# EAGLE design billdetector1a (EAGLE 5.11)
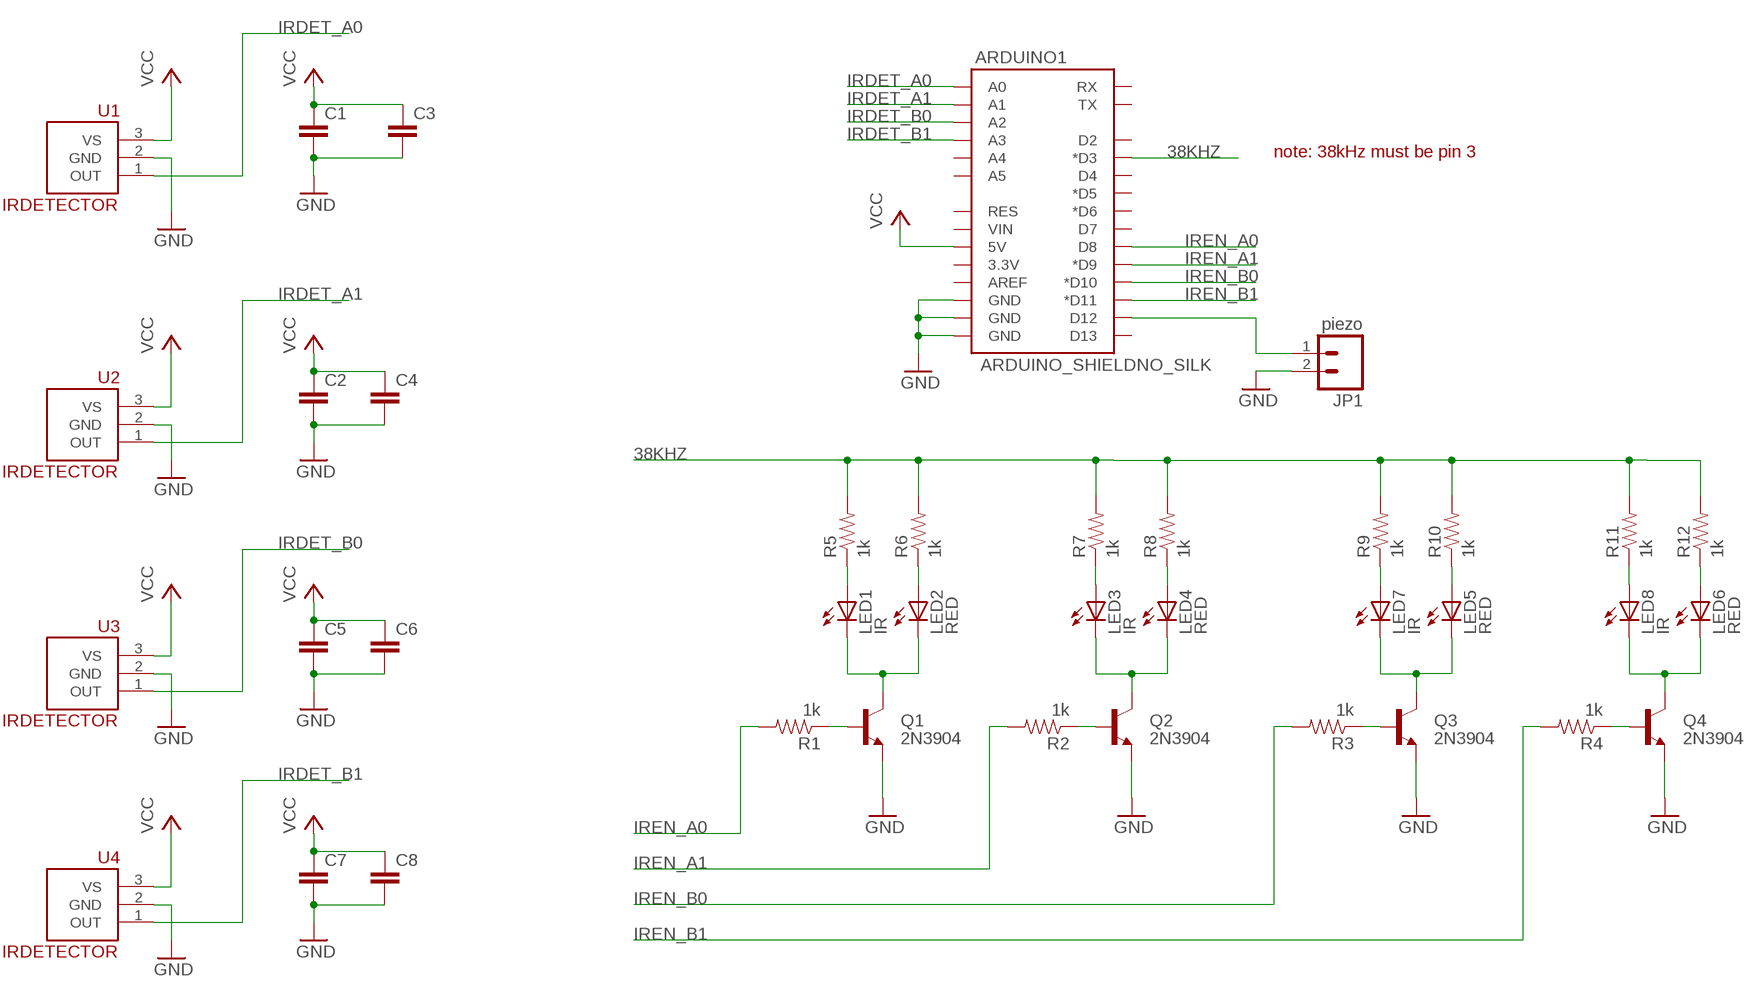
[diagram p0: schematic, sheet 1]

## Parts
ARDUINO1  ARDUINO_SHIELDNO_SILK  [DUEMILANOVE_VIAS]
C1  CAPPTH  [CAP-PTH-SMALL]
C2  CAPPTH  [CAP-PTH-SMALL]
C3  CAPPTH2  [CAP-PTH-SMALL2]
C4  CAPPTH2  [CAP-PTH-SMALL2]
C5  CAPPTH  [CAP-PTH-SMALL]
C6  CAPPTH2  [CAP-PTH-SMALL2]
C7  CAPPTH  [CAP-PTH-SMALL]
C8  CAPPTH2  [CAP-PTH-SMALL2]
JP1  piezo  M02LOCK  [1X02_LOCK]
LED1  IR  LED5MM  [LED5MM]
LED2  RED  LED5MM  [LED5MM]
LED3  IR  LED5MM  [LED5MM]
LED4  RED  LED5MM  [LED5MM]
LED5  RED  LED5MM  [LED5MM]
LED6  RED  LED5MM  [LED5MM]
LED7  IR  LED5MM  [LED5MM]
LED8  IR  LED5MM  [LED5MM]
Q1  2N3904  TRANSISTOR_NPNTO92  [TO-92]
Q2  2N3904  TRANSISTOR_NPNTO92  [TO-92]
Q3  2N3904  TRANSISTOR_NPNTO92  [TO-92]
Q4  2N3904  TRANSISTOR_NPNTO92  [TO-92]
R1  1k  RESISTORAXIAL-0.3  [AXIAL-0.3]
R2  1k  RESISTORAXIAL-0.3  [AXIAL-0.3]
R3  1k  RESISTORAXIAL-0.3  [AXIAL-0.3]
R4  1k  RESISTORAXIAL-0.3  [AXIAL-0.3]
R5  1k  RESISTORAXIAL-0.3  [AXIAL-0.3]
R6  1k  RESISTORAXIAL-0.3  [AXIAL-0.3]
R7  1k  RESISTORAXIAL-0.3  [AXIAL-0.3]
R8  1k  RESISTORAXIAL-0.3  [AXIAL-0.3]
R9  1k  RESISTORAXIAL-0.3  [AXIAL-0.3]
R10  1k  RESISTORAXIAL-0.3  [AXIAL-0.3]
R11  1k  RESISTORAXIAL-0.3  [AXIAL-0.3]
R12  1k  RESISTORAXIAL-0.3  [AXIAL-0.3]
U1  IRDETECTOR  [TSOP-3PIN-2.54MM]
U2  IRDETECTOR  [TSOP-3PIN-2.54MM]
U3  IRDETECTOR  [TSOP-3PIN-2.54MM]
U4  IRDETECTOR  [TSOP-3PIN-2.54MM]

## Nets
38KHZ: ARDUINO1.D3(*D3) R5.P$2 R6.P$2 R7.P$2 R8.P$2 R9.P$2 R10.P$2 R11.P$2 R12.P$2
GND: ARDUINO1.GND@0(GND) ARDUINO1.GND@1(GND) ARDUINO1.GND@2(GND) C1.2 C2.2 C3.2 C4.2 C5.2 C6.2 C7.2 C8.2 JP1.2 Q1.1(E) Q2.1(E) Q3.1(E) Q4.1(E) U1.2(GND) U2.2(GND) U3.2(GND) U4.2(GND)
IRDET_A0: ARDUINO1.A0 U1.1(OUT)
IRDET_A1: ARDUINO1.A1 U2.1(OUT)
IRDET_B0: ARDUINO1.A2 U3.1(OUT)
IRDET_B1: ARDUINO1.A3 U4.1(OUT)
IREN_A0: ARDUINO1.D8 R1.P$2
IREN_A1: ARDUINO1.D9(*D9) R2.P$2
IREN_B0: ARDUINO1.D10(*D10) R3.P$2
IREN_B1: ARDUINO1.D11(*D11) R4.P$2
N$1: Q3.2(B) R3.P$1
N$2: Q4.2(B) R4.P$1
N$3: LED3.A R7.P$1
N$4: LED1.K(C) LED2.K(C) Q1.3(C)
N$5: Q1.2(B) R1.P$1
N$6: Q2.2(B) R2.P$1
N$7: ARDUINO1.D12 JP1.1
N$9: LED2.A R6.P$1
N$10: LED4.A R8.P$1
N$11: LED3.K(C) LED4.K(C) Q2.3(C)
N$13: LED1.A R5.P$1
N$15: LED5.A R10.P$1
N$16: LED6.A R12.P$1
N$17: LED7.A R9.P$1
N$18: LED8.A R11.P$1
N$19: LED5.K(C) LED7.K(C) Q3.3(C)
N$20: LED6.K(C) LED8.K(C) Q4.3(C)
VCC: ARDUINO1.5V C1.1 C2.1 C3.1 C4.1 C5.1 C6.1 C7.1 C8.1 U1.3(VS) U2.3(VS) U3.3(VS) U4.3(VS)
Unconnected: ARDUINO1.3.3V ARDUINO1.A4 ARDUINO1.A5 ARDUINO1.AREF ARDUINO1.D2 ARDUINO1.D4 ARDUINO1.D5(*D5) ARDUINO1.D6(*D6) ARDUINO1.D7 ARDUINO1.D13 ARDUINO1.RES ARDUINO1.RX ARDUINO1.TX ARDUINO1.VIN

## Notes on the sheet
- note: 38kHz must be pin 3

## Library data of the parts
ARDUINO1 = SparkFun-20110517:ARDUINO_SHIELD
C1-C8 = SparkFun-20110517:CAP: Capacitor Standard 0603 ceramic capacitor, and 0.1" leaded capacitor.
JP1 = SparkFun-20110517:M02: Header 2 Standard 2-pin 0.1" header. Use with straight break away headers (SKU : PRT-00116), right angle break away headers (PRT-00553), swiss pins (PRT-00743), machine pins (PRT-00117), and female headers (PRT-00115). Molex polarized connector foot print use with SKU : PRT-08233 with associated crimp pins and housings.
LED1-LED8 = SparkFun-20110517:LED: LEDs Standard schematic elements and footprints for 5mm, 3mm, 1206, and 0603 sized LEDs. 5mm - Spark Fun Electronics SKU : COM-00529 (and others)
Q1-Q4 = SparkFun-20110517:TRANSISTOR_NPN: Transistor NPN BJT configuration in SOT23 package. MMBT2222 is the common NPN we use. Double check BCE configuration again layout.
R1-R12 = SparkFun-20110517:RESISTOR: Resistor Basic schematic elements and footprints for 0603, 1206, and PTH resistors.
U1-U4 = todstuff:IRDETECTOR: Vishay TSOP348.., TSOP344.. IR receiver modules CARRIER FREQUENCY STD (AGC2,AGC8) NOISY ENV(AGC4) 30 kHz TSOP34830 TSOP34430 33 kHz TSOP34833 TSOP34433 36 kHz TSOP34836 TSOP34436 38 kHz TSOP34838 TSOP34438 40 kHz TSOP34840 TSOP34440 56 kHz TSOP34856 TSOP34456

## Board
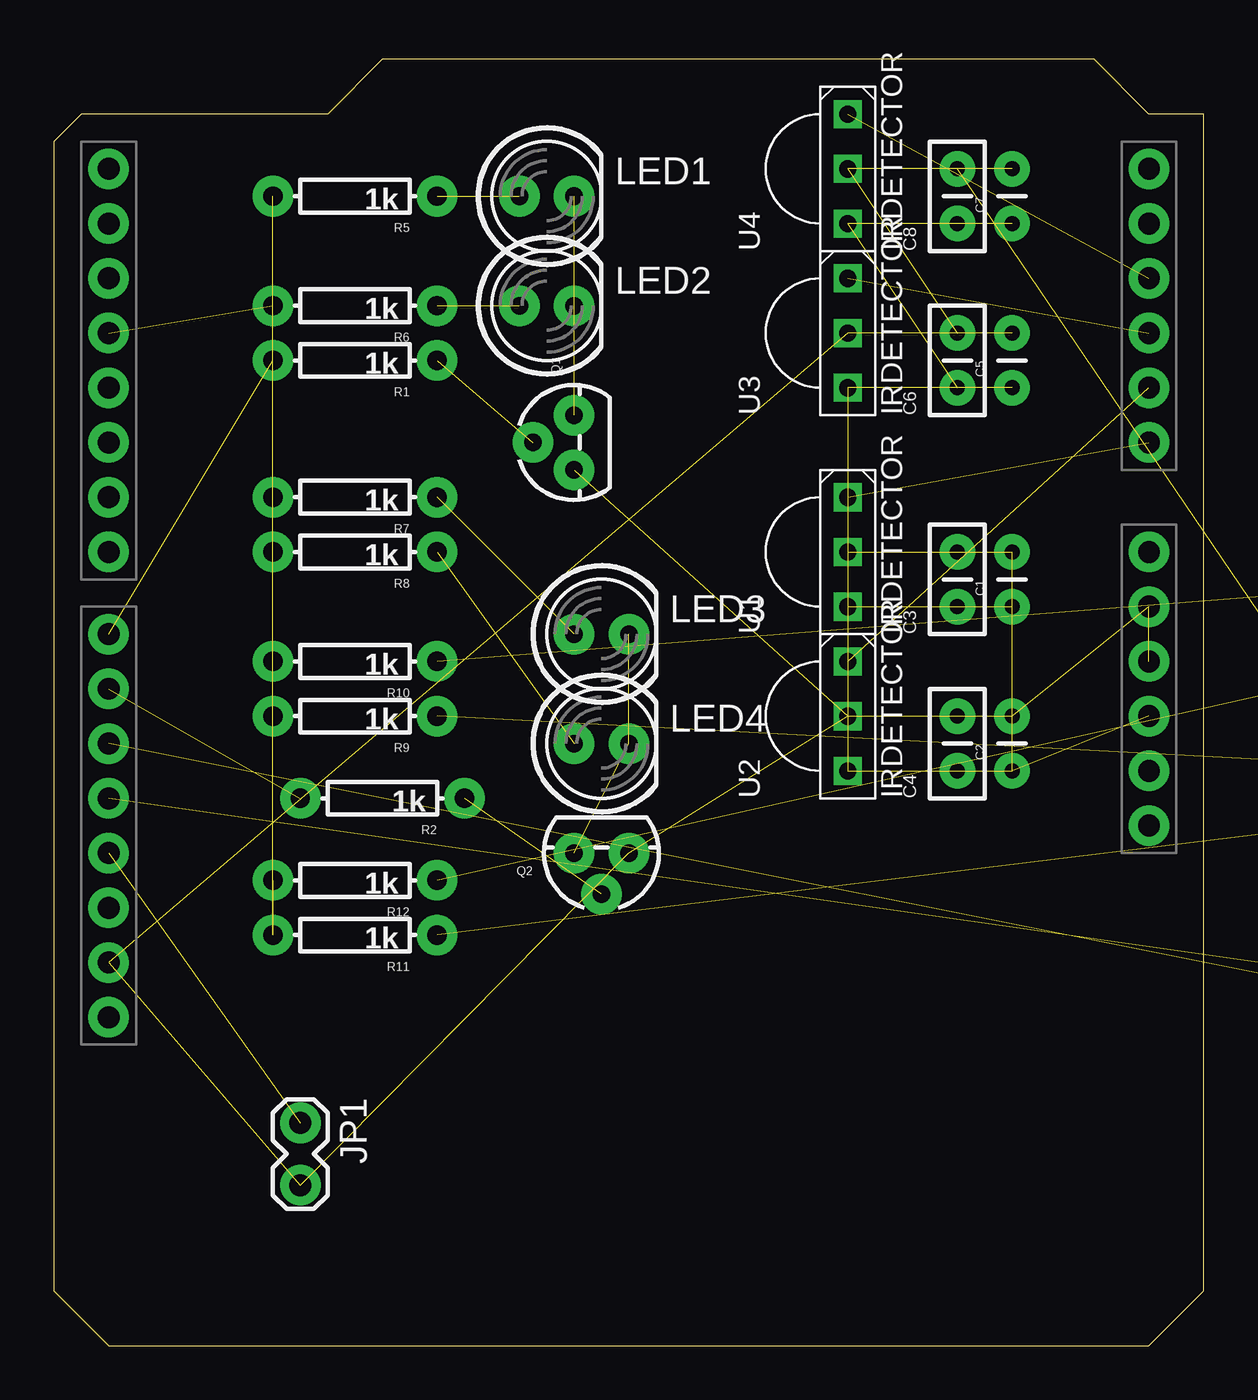
[diagram p1: board, top side]
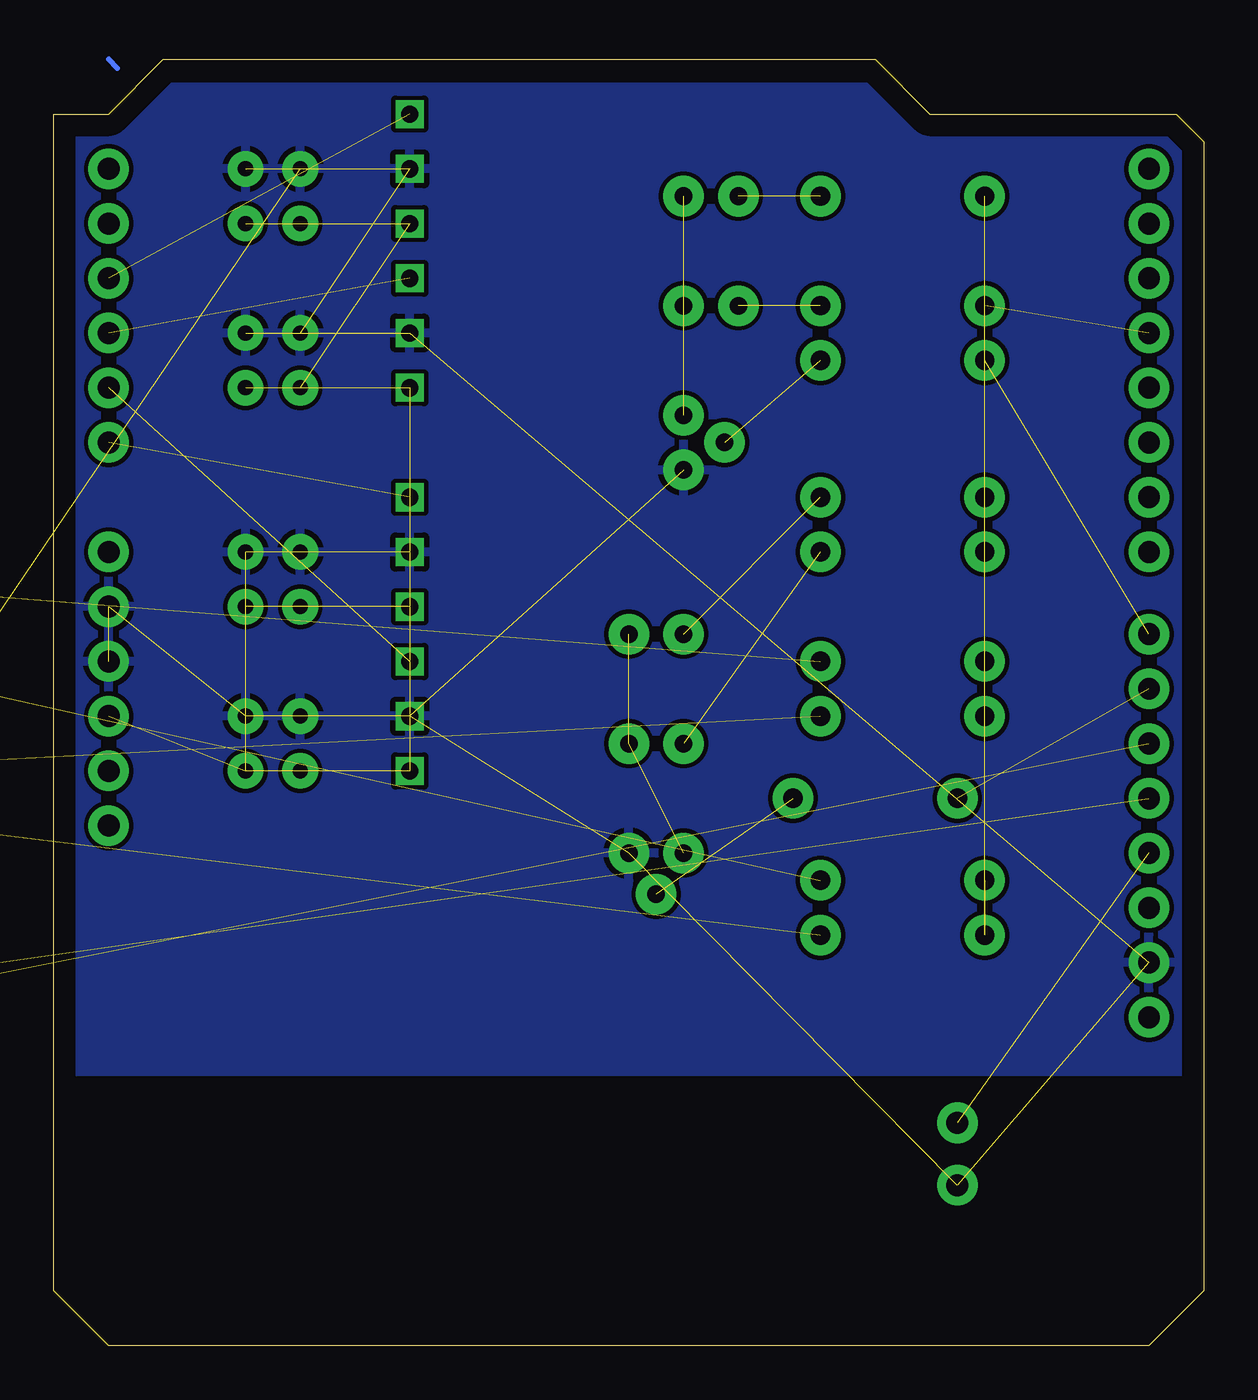
[diagram p2: board, bottom side, seen from below]

Size 53.34 x 59.69 mm. Coordinates in mm from the lower left corner, seen from the top.
Outline: 2.54,0 50.8,0 53.34,2.54 53.34,57.15 50.8,57.15 48.26,59.69 15.24,59.69 12.7,57.15 1.27,57.15 0,55.88 0,2.54 2.54,0
Copper layers (1*16): Top 0.035mm / dielectric 1.5mm / Bottom 0.035mm
Design rules "default": minimum track width 10mil, minimum drill 24mil, track to track 8mil, track to pad 8mil, pad to pad 8mil, via to via 8mil, smd to smd 8mil, copper to edge 40mil, drill to drill 8mil, minimum pad ring 10mil, minimum via ring 8mil, stop-mask expansion 4mil, vias tented up to drill 0mil, thermal gap 10mil

### Footprints (pad centres in the part's own frame; a part is rotated, then mirrored left to right if it is on the bottom)
DUEMILANOVE_VIAS = drill 1.016 pad 1.88 round: 3.3V 50.8,13.97; 5V 50.8,16.51; A0 50.8,29.21; A1 50.8,31.75; A2 50.8,34.29; A3 50.8,36.83; A4 50.8,39.37; A5 50.8,41.91; AREF 2.54,2.54; D2 2.54,36.83; D3 2.54,34.29; D4 2.54,31.75; D5 2.54,29.21; D6 2.54,26.67; D7 2.54,24.13; D8 2.54,20.32; D9 2.54,17.78; D10 2.54,15.24; D11 2.54,12.7; D12 2.54,10.16; D13 2.54,7.62; GND@0 50.8,19.05; GND@1 50.8,21.59; GND@2 2.54,5.08; RES 50.8,11.43; RX 2.54,41.91; TX 2.54,39.37; VIN 50.8,24.13
CAP-PTH-SMALL = drill 0.7 pad 1.651 round: 1 0,0; 2 2.54,0
CAP-PTH-SMALL2 = drill 0.7 pad 1.651 round: 1 0,0; 2 2.54,0
1X02_LOCK = drill 1.016 pad 1.88 round: 1 -0.178,0; 2 2.718,0
LED5MM = drill 0.813 pad 1.88 round: A -1.27,0; K 1.27,0
TO-92 = drill 0.813 pad 1.88 round: 1 -1.27,0; 2 0,1.905; 3 1.27,0
AXIAL-0.3 = drill 0.9 pad 1.88 round: P$1 -3.81,0; P$2 3.81,0
TSOP-3PIN-2.54MM = drill 0.8 square: 1 5.08,0; 2 2.54,0; 3 0,0

### Placement (x,y rotation side)
ARDUINO1  0,12.7 0 top
C1  44.45,34.29 90 top
C2  44.45,26.67 90 top
C3  41.91,34.29 90 top
C4  41.91,26.67 90 top
C5  44.45,44.45 90 top
C6  41.91,44.45 90 top
C7  44.45,52.07 90 top
C8  41.91,52.07 90 top
JP1  11.43,10.16 270 top
LED1  22.86,53.34 0 top
LED2  22.86,48.26 0 top
LED3  25.4,33.02 0 top
LED4  25.4,27.94 0 top
LED5  67.31,35.56 0 top  (outside the outline)
LED6  81.28,35.56 0 top  (outside the outline)
LED7  67.31,26.67 0 top  (outside the outline)
LED8  81.28,26.67 0 top  (outside the outline)
Q1  24.13,41.91 90 top
Q2  25.4,22.86 180 top
Q3  67.31,19.05 0 top  (outside the outline)
Q4  77.47,19.05 0 top  (outside the outline)
R1  13.97,45.72 180 top
R2  15.24,25.4 180 top
R3  68.58,13.97 0 top  (outside the outline)
R4  78.74,13.97 0 top  (outside the outline)
R5  13.97,53.34 180 top
R6  13.97,48.26 180 top
R7  13.97,39.37 180 top
R8  13.97,36.83 180 top
R9  13.97,29.21 180 top
R10  13.97,31.75 180 top
R11  13.97,19.05 180 top
R12  13.97,21.59 180 top
U1  36.83,34.29 90 top
U2  36.83,26.67 90 top
U3  36.83,44.45 90 top
U4  36.83,52.07 90 top

### Tracks (layer width: path | path; a pad name or v marks a point on that pad's centre or on a via)
38KHZ  (8 unrouted)
GND  (19 unrouted)
  pour Bottom: 0,12.7 53.34,12.7 53.34,58.42 0,58.42
IRDET_A0  (1 unrouted)
IRDET_A1  (1 unrouted)
IRDET_B0  (1 unrouted)
IRDET_B1  (1 unrouted)
IREN_A0  (1 unrouted)
IREN_A1  (1 unrouted)
IREN_B0  (1 unrouted)
IREN_B1  (1 unrouted)
N$1  (1 unrouted)
N$2  (1 unrouted)
N$3  (1 unrouted)
N$4  (2 unrouted)
N$5  (1 unrouted)
N$6  (1 unrouted)
N$7  (1 unrouted)
N$8
  Bottom 0.254: 50.39,59.28 50.8,59.69
N$9  (1 unrouted)
N$10  (1 unrouted)
N$11  (2 unrouted)
N$13  (1 unrouted)
N$15  (1 unrouted)
N$16  (1 unrouted)
N$17  (1 unrouted)
N$18  (1 unrouted)
N$19  (2 unrouted)
N$20  (2 unrouted)
VCC  (12 unrouted)